# Altium schematic sheet LNA_1.7GHz_main_symbol.SchDoc: {Наименование}
size 420 x 297 mm; ApprovedBy: {Утвердил}; CheckedBy: {Проверил}; DrawnBy: {Разраб.}; DocumentNumber: АБВГ 123456.789 00; SheetNumber: 1; SheetTotal: 3; Scale: {Мш.}; PageSetup: Record=PageOptions|CenterHorizontal=False|CenterVertical=False|PrintScale=0.95|XCorrection=0.00|YCorrection=0.00|PrintKind=1|BorderSize=5000000|LeftOffset=0|BottomOffset=0|Orientation=1|PaperLength=1000|PaperWidth=1000|Scale=100|PaperSource=15|PrintQuality=600|MediaType=1|DitherType=10|PaperKind=A4|PrintScaleMode=1; ProcessInspection: {Т.контр.}; Mass: {М.}; NormInspection: {Н.контр.}; Letter1Column: {}; Letter2Column: {}; Letter3Column: {}; DocumentType: {Документ}; Rule: PcbType=ProtelPcb
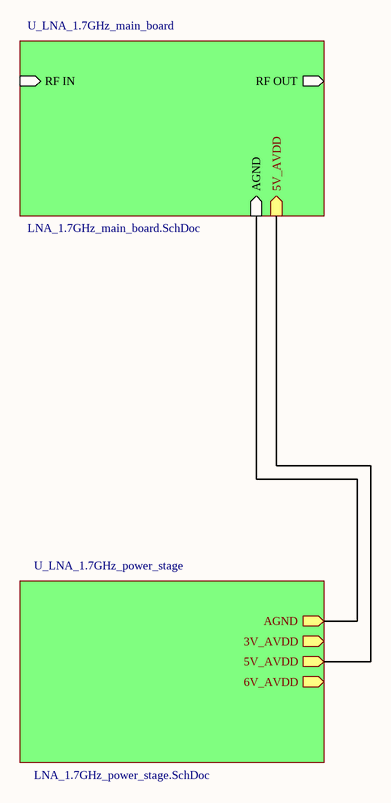
[diagram p0: LNA_1.7GHz_main_symbol.SchDoc]

## Sub-sheets
U_LNA_1.7GHz_main_board = LNA_1.7GHz_main_board.SchDoc: RF IN (in), AGND (in), RF OUT (out), 5V_AVDD (in)
U_LNA_1.7GHz_power_stage = LNA_1.7GHz_power_stage.SchDoc: AGND (out), 3V_AVDD (out), 6V_AVDD (out), 5V_AVDD (out)

## Nets
(unnamed): sheet U_LNA_1.7GHz_main_board/AGND, sheet U_LNA_1.7GHz_power_stage/AGND
(unnamed): sheet U_LNA_1.7GHz_main_board/5V_AVDD, sheet U_LNA_1.7GHz_power_stage/5V_AVDD

## Notes on the sheet
- Перв. примен.
- Справ. №
- Подп. и дата
- Инв. № дубл.
- Взам. инв. №
- Изм.
- Лист
- № докум.
- Подп.
- Дата
- Лит.
- Масса
- Масштаб
- Т.контр.
- Пров.
- Разраб.
- Листов
- Инв. № подл.
- Н.контр.
- Утв.
- Копировал
- Формат А3